# Altium project S7V30.PrjPCB (part 2 of 2)

## Sheet S7_LoRa.SchDoc
size A3
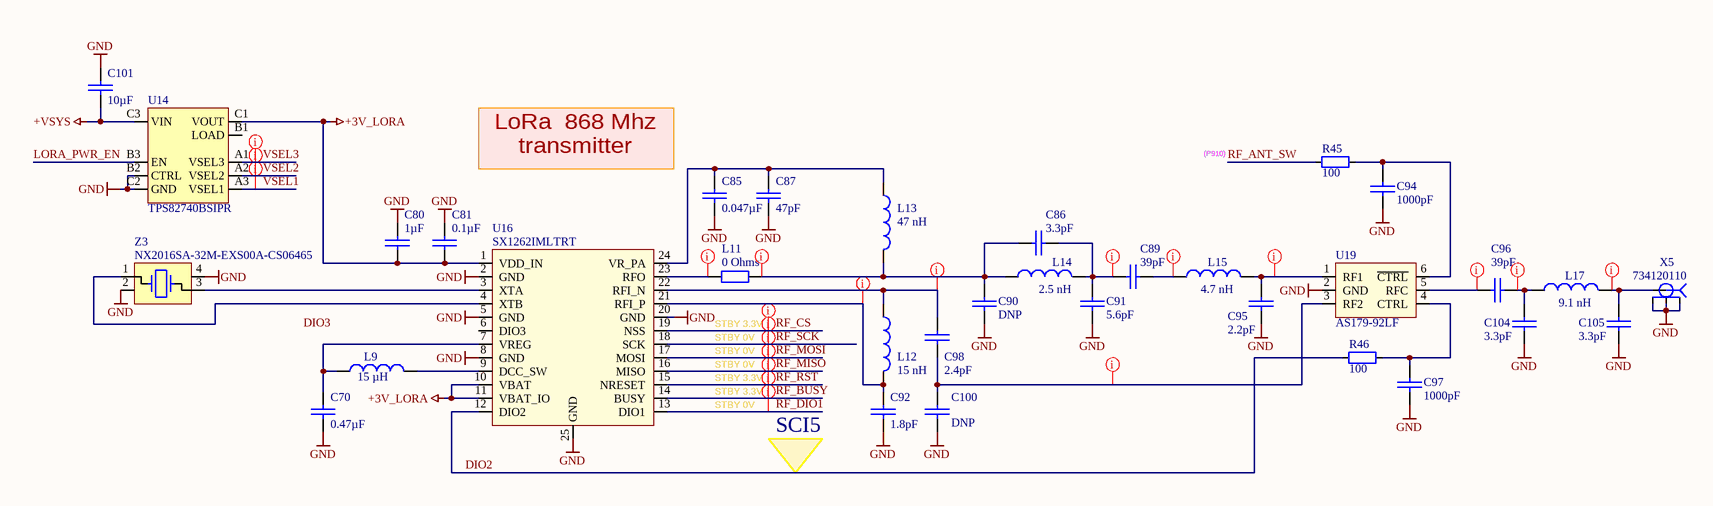
[diagram p3: S7_LoRa.SchDoc]

### Parts
C70  value 0.47µF  [0402 CAP]  (hidden comment: GRT155R61E474ME01D)
C80  value 1µF  [0402 CAP]  (hidden comment: TMK105BJ105MV-F)
C81  value 0.1µF  [0402 CAP]  (hidden comment: 0402B104K500CT)
C85  value 0.047µF  [0402 CAP]  (hidden comment: CC0402KRX7R8BB473)
C86  value 3.3pF  [0402 CAP]  (hidden comment: 885392005011)
C87  value 47pF  [0402 CAP]  (hidden comment: GJM1555C1H470FB01D)
C89  value 39pF  [0402 CAP]  (hidden comment: GJM1555C1H390JB01D)
C90  value DNP  [0402 CAP]  (hidden comment: Capacitor_0402)  (no BOM)
C91  value 5.6pF  [0402 CAP]  (hidden comment: GJM1555C1H5R6BB01D)
C92  value 1.8pF  [0402 CAP]  (hidden comment: GJM1555C1H1R8BB01D)
C94  value 1000pF  [0402 CAP]  (hidden comment: C1005CH1H102J050BA)
C95  value 2.2pF  [0402 CAP]  (hidden comment: CBR04C229B5GAC)
C96  value 39pF  [0402 CAP]  (hidden comment: GJM1555C1H390JB01D)
C97  value 1000pF  [0402 CAP]  (hidden comment: C1005CH1H102J050BA)
C98  value 2.4pF  [0402 CAP]  (hidden comment: GJM1555C1H2R4BB01D)
C100  value DNP  [0402 CAP]  (hidden comment: Capacitor_0402)  (no BOM)
C101  value 10µF  [0603 CAP]  (hidden comment: GRT188R61C106KE13D)
C104  value 3.3pF  [0402 CAP]  (hidden comment: 885392005011)
C105  value 3.3pF  [0402 CAP]  (hidden comment: 885392005011)
L9  value 15 µH  [2012[0805]]  (hidden comment: LQM21DH150M70L)
L11  value 0 Ohms  [INDC1005-0402]  (hidden comment: CRCW04020000Z0ED)
L12  value 15 nH  [INDC1005-0402]  (hidden comment: LQW15AN15NH00D)
L13  value 47 nH  [INDC1005-0402]  (hidden comment: LQW15AN47NJ00D)
L14  value 2.5 nH  [INDC1005-0402]  (hidden comment: LQW15AN2N5C00D)
L15  value 4.7 nH  [INDC1005-0402]  (hidden comment: LQW15AN4N7C00D)
L17  value 9.1 nH  [INDC1005-0402]  (hidden comment: LQW15AN9N1H00D)
R45  value 100  [0402]  (hidden comment: RMCF0402FT100R)
R46  value 100  [0402]  (hidden comment: RMCF0402FT100R)
U14  TPS82740BSIPR  [MicroSiP]
U16  SX1262IMLTRT  [VQFN24]
U19  AS179-92LF  [SC70-6]
X5  734120110  [0734120110]
Z3  NX2016SA-32M-EXS00A-CS06465  [4-SMD 2.00mm x 1.60mm]

### Nets
+3V_LORA: C80.2 C81.2 U14.C1(VOUT) U16.1(VDD_IN) U16.10(VBAT) U16.11(VBAT_IO)
+VSYS: C101.2 U14.C3(VIN)
GND: C70.2 C80.1 C81.1 C85.2 C87.2 C90.2 C91.2 C92.2 C94.1 C95.2 C97.1 C100.2 C101.1 C104.1 C105.1 U14.B2(CTRL) U14.C2(GND) U16.2(GND) U16.5(GND) U16.8(GND) U16.20(GND) U16.25(GND) U19.2(GND) X5.2 X5.3 X5.4 Z3.2 Z3.4
DIO2: R46.2 U16.12(DIO2)
LORA_PWR_EN: U14.B3(EN)
RF_ANT_SW: R45.2
RF_BUSY: U16.14(BUSY)
RF_CS: U16.19(NSS)
RF_DIO1: U16.13(DIO1)
RF_MISO: U16.16(MISO)
RF_MOSI: U16.17(MOSI)
RF_RST: U16.15(NRESET)
RF_SCK: U16.18(SCK)
VSEL1: U14.A3(VSEL1)
VSEL2: U14.A2(VSEL2)
VSEL3: U14.A1(VSEL3)
NetC70_1: C70.1 L9.1 U16.7(VREG)
NetC85_1: C85.1 C87.1 L13.1 U16.24(VR_PA)
NetC86_1: C86.1 C90.1 L11.2 L13.2 L14.1
NetC86_2: C86.2 C89.1 C91.1 L14.2
NetC89_2: C89.2 L15.1
NetC92_1: C92.1 L12.2 U16.21(RFI_P)
NetC94_2: C94.2 R45.1 U19.6(~{CTRL})
NetC95_1: C95.1 L15.2 U19.1(RF1)
NetC96_1: C96.1 U19.5(RFC)
NetC96_2: C96.2 C104.2 L17.1
NetC97_2: C97.2 R46.1 U19.4(CTRL)
NetC98_1: C98.1 L12.1 U16.22(RFI_N)
NetC98_2: C98.2 C100.1 U19.3(RF2)
NetC105_2: C105.2 L17.2 X5.1(Sig)
NetL9_2: L9.2 U16.9(DCC_SW)
NetL11_1: L11.1 U16.23(RFO)
NetU16_3: U16.3(XTA) Z3.3
NetU16_4: U16.4(XTB) Z3.1

Not connected (* = marked no-connect by the designer): U14 B1(LOAD); U16 6(DIO3)

### Layout directives
net class RF: NetC86_1, NetC86_2, NetC89_2, NetC92_1, NetC95_1, NetC96_1, NetC96_2, NetC98_1, NetC98_2, NetC105_2, NetL11_1
net class VSEL: VSEL1, VSEL2, VSEL3
net class LoRa: RF_BUSY, RF_CS, RF_DIO1, RF_MISO, RF_MOSI, RF_RST, RF_SCK

### Notes on the sheet
- (near C85) LoRa  868 Mhz transmitter
- (P910)
- STBY 3.3V
- STBY 0V
- SCI5
- Labels drawn without touching a wire or pin: DIO3

### Library data of the parts
C70 = GRT155R61E474ME01D: 0.47µF, ±20%, 25V, X5R, 0402 (1005 Metric), -55°C ~ 85°C, -, Automotive; Manufacturer: Murata Electronics North America; PartNum: 490-12270-1-ND; Voltage - Rated: 25V; Part Number: GRT155R61E474ME01D; Distributor: Digi-Key; PartName: GRT155R61E474ME01D; Price: 0.13000; Tolerance: ±20%; Temperature Coefficient: X5R; Operating Temperature: -55°C ~ 85°C; Features: -; Package / Case: 0402 (1005 Metric)
C80 = TMK105BJ105MV-F: 1µF, ±20%, 25V, X5R, 0402 (1005 Metric), -55°C ~ 85°C, -, General Purpose; Manufacturer: Taiyo Yuden; PartNum: 587-3245-1-ND; Voltage - Rated: 25V; Part Number: TMK105BJ105MV-F; Distributor: Digi-Key; PartName: TMK105BJ105MV-F; Price: 0.22000; Tolerance: ±20%; Temperature Coefficient: X5R; Operating Temperature: -55°C ~ 85°C; Features: -; Package / Case: 0402 (1005 Metric)
C81 = 0402B104K500CT: as C3 on sheet S7_Power; Voltage - Rated: 50V; Part Number: 0402B104K500CT; Distributor: Digi-Key; PartName: 0402B104K500CT; Price: 0.19000; Tolerance: ±10%; Temperature Coefficient: X7R; Operating Temperature: -55°C ~ 125°C; Features: -; Package / Case: 0402 (1005 Metric)
C85 = CC0402KRX7R8BB473: 0.047µF, ±10%, 25V, X7R, 0402 (1005 Metric), -55°C ~ 125°C, -, General Purpose; Manufacturer: Yageo; PartNum: 311-1717-1-ND; Voltage - Rated: 25V; Part Number: CC0402KRX7R8BB473; Distributor: Digi-Key; PartName: CC0402KRX7R8BB473; Price: 0.10000; Tolerance: ±10%; Temperature Coefficient: X7R; Operating Temperature: -55°C ~ 125°C; Features: -; Package / Case: 0402 (1005 Metric)
C86 C104 C105 = 885392005011: 3.3pF, ±0.1pF, 50V, C0G, NP0, 0402 (1005 Metric), -55°C ~ 125°C, -, RF, Microwave, High Frequency; Manufacturer: Wurth Electronics Inc.; PartNum: 732-13236-1-ND; Voltage - Rated: 50V; Part Number: 885392005011; Distributor: Digi-Key; PartName: 885392005011; Price: 0.10000; Tolerance: ±0.1pF; Temperature Coefficient: C0G, NP0; Operating Temperature: -55°C ~ 125°C; Features: -; Package / Case: 0402 (1005 Metric)
C87 = GJM1555C1H470FB01D: 47pF, ±1%, 50V, C0G, NP0, 0402 (1005 Metric), -55°C ~ 125°C, High Q, Low Loss, RF, Microwave, High Frequency; Manufacturer: Murata Electronics North America; PartNum: 490-16376-1-ND; Voltage - Rated: 50V; Part Number: GJM1555C1H470FB01D; Distributor: Digi-Key; PartName: GJM1555C1H470FB01D; Price: 0.28000; Tolerance: ±1%; Temperature Coefficient: C0G, NP0; Operating Temperature: -55°C ~ 125°C; Features: High Q, Low Loss; Package / Case: 0402 (1005 Metric)
C89 C96 = GJM1555C1H390JB01D: 39pF, ±5%, 50V, C0G, NP0, 0402 (1005 Metric), -55°C ~ 125°C, High Q, Low Loss, RF, Microwave, High Frequency; Manufacturer: Murata Electronics North America; PartNum: 490-17673-1-ND; Voltage - Rated: 50V; Part Number: GJM1555C1H390JB01D; Distributor: Digi-Key; PartName: GJM1555C1H390JB01D; Price: 0.24000; Tolerance: ±5%; Temperature Coefficient: C0G, NP0; Operating Temperature: -55°C ~ 125°C; Features: High Q, Low Loss; Package / Case: 0402 (1005 Metric)
C91 = GJM1555C1H5R6BB01D: 5.6pF, ±0.1pF, 50V, C0G, NP0, 0402 (1005 Metric), -55°C ~ 125°C, High Q, Low Loss, RF, Microwave, High Frequency; Manufacturer: Murata Electronics North America; PartNum: 490-11225-1-ND; Voltage - Rated: 50V; Part Number: GJM1555C1H5R6BB01D; Distributor: Digi-Key; PartName: GJM1555C1H5R6BB01D; Price: 0.19000; Tolerance: ±0.1pF; Temperature Coefficient: C0G, NP0; Operating Temperature: -55°C ~ 125°C; Features: High Q, Low Loss; Package / Case: 0402 (1005 Metric)
C92 = GJM1555C1H1R8BB01D: 1.8pF, ±0.1pF, 50V, C0G, NP0, 0402 (1005 Metric), -55°C ~ 125°C, High Q, Low Loss, RF, Microwave, High Frequency; Manufacturer: Murata Electronics North America; PartNum: 490-8089-1-ND; Voltage - Rated: 50V; Part Number: GJM1555C1H1R8BB01D; Distributor: Digi-Key; PartName: GJM1555C1H1R8BB01D; Price: 0.19000; Tolerance: ±0.1pF; Temperature Coefficient: C0G, NP0; Operating Temperature: -55°C ~ 125°C; Features: High Q, Low Loss; Package / Case: 0402 (1005 Metric)
C94 C97 = C1005CH1H102J050BA: 1000pF, ±5%, 50V, CH, 0402 (1005 Metric), -25°C ~ 85°C, Low ESL, General Purpose; Manufacturer: TDK Corporation; PartNum: 445-10829-1-ND; Voltage - Rated: 50V; Part Number: C1005CH1H102J050BA; Distributor: Digi-Key; PartName: C1005CH1H102J050BA; Price: 0.19000; Tolerance: ±5%; Temperature Coefficient: CH; Operating Temperature: -25°C ~ 85°C; Features: Low ESL; Package / Case: 0402 (1005 Metric)
C95 = CBR04C229B5GAC: 2.2pF, ±0.1pF, 50V, C0G, NP0, 0402 (1005 Metric), -55°C ~ 125°C, High Q, Low Loss, RF, Microwave, High Frequency; Manufacturer: KEMET; PartNum: 399-17527-1-ND; Voltage - Rated: 50V; Part Number: CBR04C229B5GAC; Distributor: Digi-Key; PartName: CBR04C229B5GAC; Price: 0.19000; Tolerance: ±0.1pF; Temperature Coefficient: C0G, NP0; Operating Temperature: -55°C ~ 125°C; Features: High Q, Low Loss; Package / Case: 0402 (1005 Metric)
C98 = GJM1555C1H2R4BB01D: 2.4pF, ±0.1pF, 50V, C0G, NP0, 0402 (1005 Metric), -55°C ~ 125°C, High Q, Low Loss, RF, Microwave, High Frequency; Manufacturer: Murata Electronics North America; PartNum: 490-8093-1-ND; Voltage - Rated: 50V; Part Number: GJM1555C1H2R4BB01D; Distributor: Digi-Key; PartName: GJM1555C1H2R4BB01D; Price: 0.19000; Tolerance: ±0.1pF; Temperature Coefficient: C0G, NP0; Operating Temperature: -55°C ~ 125°C; Features: High Q, Low Loss; Package / Case: 0402 (1005 Metric)
C101 = GRT188R61C106KE13D: as C1 on sheet S7_Power; Voltage - Rated: 16V; Part Number: GRT188R61C106KE13D; Distributor: Digi-Key; PartName: GRT188R61C106KE13D; Price: 0.22770; Tolerance: ±10%; Temperature Coefficient: X5R; Operating Temperature: -55°C ~ 85°C; Features: -; Package / Case: 0603 (1608 Metric)
L9 = LQM21DH150M70L: 15 µH Shielded Multilayer Inductor 250 mA, 1.235Ohm, 24MHz Max 0805 (2012 Metric); Manufacturer: Murata Electronics; PartNum: 490-LQM21DH150M70LCT-ND; Tolerance: ±20%; Distributor: Digi-Key; Price: 0.16$; PartName: LQM21DH150M70L
L11 = CRCW04020000Z0ED: 0 Ohms Jumper 0.063W, 1/16W Chip Resistor 0402 (1005 Metric) Automotive AEC-Q200 Thick Film; Manufacturer: Vishay Dale; PartNum: 541-0.0JCT-ND; Distributor: Digi-Key; PartName: CRCW04020000Z0ED
L12 = LQW15AN15NH00D: 15nH Unshielded Wirewound Inductor 460mA 160 mOhm Max 0402 (1006 Metric); Manufacturer: Murata; PartNum: 490-6772-1-ND; Tolerance: ±3%; Distributor: Digi-Key; PartName: LQW15AN15NH00D
L13 = LQW15AN47NJ00D: 47nH Unshielded Wirewound Inductor 210mA 1.08 Ohm Max 0402 (1005 Metric); Manufacturer: Murata; PartNum: 490-1154-1-ND; Tolerance: ±5%; Distributor: Digi-Key; PartName: LQW15AN47NJ00D
L14 = LQW15AN2N5C00D: 2.5nH Unshielded Wirewound Inductor 850mA 50 mOhm Max 0402 (1006 Metric); Manufacturer: Murata; PartNum: 490-6798-1-ND; Tolerance: ±0.2nH; Distributor: Digi-Key; PartName: LQW15AN2N5C00D
L15 = LQW15AN4N7C00D: 4.7nH Unshielded Wirewound Inductor 750mA 70 mOhm Max 0402 (1006 Metric); Manufacturer: Murata Electronics North America; PartNum: 490-1139-1-ND; Tolerance: ±0.2nH; Distributor: Digi-Key; PartName: LQW15AN4N7C00D
L17 = LQW15AN9N1H00D: 9.1nH Unshielded Wirewound Inductor 540mA 140 mOhm Max 0402 (1006 Metric); Manufacturer: Murata Electronics North America; PartNum: 490-8444-1-ND; Tolerance: ±3%; Distributor: Digi-Key; PartName: LQW15AN9N1H00D
R45 R46 = RMCF0402FT100R: 100 Ohms, ±1%, 0.063W, 1/16W, Thick Film, ±100ppm/°C, 0402 (1005 Metric), -55°C ~ 155°C, Automotive AEC-Q200; Manufacturer: Stackpole Electronics Inc; PartNum: RMCF0402FT100RCT-ND; Voltage: 75V; Distributor: Digi-Key; Price: 0.10000; Tolerance: ±1%; PartName: RMCF0402FT100R; Part Number: RMCF0402FT100R; Temperature Coefficient: ±100ppm/°C; Operating Temperature: -55°C ~ 155°C; Power (Watts): 0.063W, 1/16W; Features: Automotive AEC-Q200; Package / Case: 0402 (1005 Metric)
U14 = TPS82740BSIPR: Non-Isolated PoL Module DC DC Converter 1 Output 2.6 ~ 3.3V 200mA 2.2V - 5.5V Input, 3.0mm x 2.4mm x 1.0mm, -40...85 C; Manufacturer: Texas Instruments; PartNum: 296-46481-1-ND; Distributor: Digi-Key; price: 2.88$; PartName: TPS82740BSIPR
U16 = SX1262IMLTRT: IC RF TxRx Only General ISM < 1GHz LoRaWAN 150MHz ~ 960MHz 24-VFQFN Exposed Pad; Manufacturer: Semtech Corporation; PartName: SX1262IMLTRTCT-ND; Distributor: Digi-Key; PartNum: SX1262IMLTRT; Price: 7.94$
U19 = AS179-92LF: RF Switch IC 802.11b, g, Bluetooth, WLAN SPDT 3 GHz 50Ohm SC-70-6, -40°C ~ 85°C; Manufacturer: Skyworks Solutions Inc.; PartNum: 863-1003-1-ND; Distributor: Digi-Key; PartName: AS179-92LF
X5 = 0734120110: U.FL (UMCC) Connector Receptacle, Male Pin 50 Ohm Surface Mount Solder; Manufacturer: Molex; PartNum: WM5587TR-ND; Distributor: Digi-Key; PartName: 0734120110
Z3 = NX2016SA-32M-EXS00A-CS06465: 32 MHz Crystal 10pF,  60 Ohms, 10 ppm,  4-SMD, No Lead, -40...+85 С; Manufacturer: NDK America, Inc.; PartNum: 644-1300-1-ND; Tolerance: ±1ppm; Value: 32 MHz; Distributor: Digi-Key; Price: 0.38$; PartName: NX2016SA-32M-EXS00A-CS06465

## Sheet S7_SDRAM.SchDoc
size A3
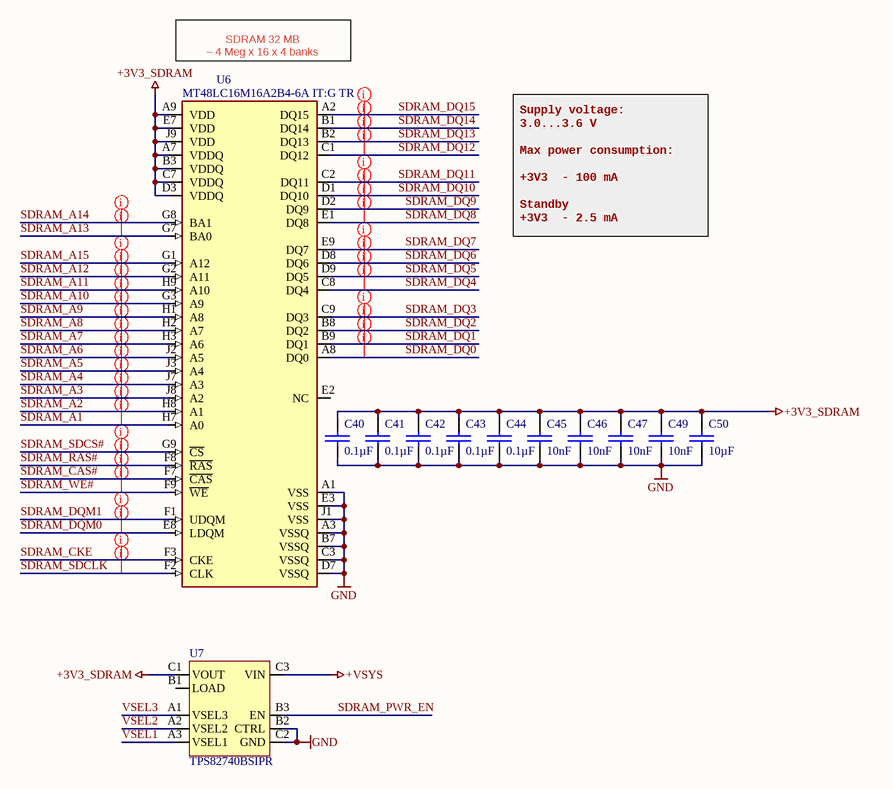
[diagram p4: S7_SDRAM.SchDoc]

### Parts
C40  value 0.1µF  [0402 CAP]  (hidden comment: 0402B104K500CT)
C41  value 0.1µF  [0402 CAP]  (hidden comment: 0402B104K500CT)
C42  value 0.1µF  [0402 CAP]  (hidden comment: 0402B104K500CT)
C43  value 0.1µF  [0402 CAP]  (hidden comment: 0402B104K500CT)
C44  value 0.1µF  [0402 CAP]  (hidden comment: 0402B104K500CT)
C45  value 10nF  [0402 CAP]  (hidden comment: CL05B103KB5NNNC)
C46  value 10nF  [0402 CAP]  (hidden comment: CL05B103KB5NNNC)
C47  value 10nF  [0402 CAP]  (hidden comment: CL05B103KB5NNNC)
C49  value 10nF  [0402 CAP]  (hidden comment: CL05B103KB5NNNC)
C50  value 10µF  [0603 CAP]  (hidden comment: GRT188R61C106KE13D)
U6  MT48LC16M16A2B4-6A IT:G TR  [MICRON_VFBGA54]
U7  TPS82740BSIPR  [MicroSiP]

### Nets
+3V3_SDRAM: C40.1 C41.1 C42.1 C43.1 C44.1 C45.1 C46.1 C47.1 C49.1 C50.1 U6.A7(VDDQ) U6.A9(VDD) U6.B3(VDDQ) U6.C7(VDDQ) U6.D3(VDDQ) U6.E7(VDD) U6.J9(VDD) U7.C1(VOUT)
+VSYS: U7.C3(VIN)
GND: C40.2 C41.2 C42.2 C43.2 C44.2 C45.2 C46.2 C47.2 C49.2 C50.2 U6.A1(VSS) U6.A3(VSSQ) U6.B7(VSSQ) U6.C3(VSSQ) U6.D7(VSSQ) U6.E3(VSS) U6.J1(VSS) U7.B2(CTRL) U7.C2(GND)
SDRAM_A1: U6.H7(A0)
SDRAM_A2: U6.H8(A1)
SDRAM_A3: U6.J8(A2)
SDRAM_A4: U6.J7(A3)
SDRAM_A5: U6.J3(A4)
SDRAM_A6: U6.J2(A5)
SDRAM_A7: U6.H3(A6)
SDRAM_A8: U6.H2(A7)
SDRAM_A9: U6.H1(A8)
SDRAM_A10: U6.G3(A9)
SDRAM_A11: U6.H9(A10)
SDRAM_A12: U6.G2(A11)
SDRAM_A13: U6.G7(BA0)
SDRAM_A14: U6.G8(BA1)
SDRAM_A15: U6.G1(A12)
SDRAM_CAS#: U6.F7(~{CAS})
SDRAM_CKE: U6.F3(CKE)
SDRAM_DQ0: U6.A8(DQ0)
SDRAM_DQ1: U6.B9(DQ1)
SDRAM_DQ2: U6.B8(DQ2)
SDRAM_DQ3: U6.C9(DQ3)
SDRAM_DQ4: U6.C8(DQ4)
SDRAM_DQ5: U6.D9(DQ5)
SDRAM_DQ6: U6.D8(DQ6)
SDRAM_DQ7: U6.E9(DQ7)
SDRAM_DQ8: U6.E1(DQ8)
SDRAM_DQ9: U6.D2(DQ9)
SDRAM_DQ10: U6.D1(DQ10)
SDRAM_DQ11: U6.C2(DQ11)
SDRAM_DQ12: U6.C1(DQ12)
SDRAM_DQ13: U6.B2(DQ13)
SDRAM_DQ14: U6.B1(DQ14)
SDRAM_DQ15: U6.A2(DQ15)
SDRAM_DQM0: U6.E8(LDQM)
SDRAM_DQM1: U6.F1(UDQM)
SDRAM_PWR_EN: U7.B3(EN)
SDRAM_RAS#: U6.F8(~{RAS})
SDRAM_SDCLK: U6.F2(CLK)
SDRAM_SDCS#: U6.G9(~{CS})
SDRAM_WE#: U6.F9(~{WE})
VSEL1: U7.A3(VSEL1)
VSEL2: U7.A2(VSEL2)
VSEL3: U7.A1(VSEL3)

Not connected (* = marked no-connect by the designer): U6 E2(NC); U7 B1(LOAD)

### Layout directives
net class SDRAM_D: SDRAM_DQ0, SDRAM_DQ1, SDRAM_DQ2, SDRAM_DQ3, SDRAM_DQ4, SDRAM_DQ5, SDRAM_DQ6, SDRAM_DQ7, SDRAM_DQ8, SDRAM_DQ9, SDRAM_DQ10, SDRAM_DQ11, SDRAM_DQ12, SDRAM_DQ13, SDRAM_DQ14, SDRAM_DQ15
net class SDRAM_A: SDRAM_A1, SDRAM_A2, SDRAM_A3, SDRAM_A4, SDRAM_A5, SDRAM_A6, SDRAM_A7, SDRAM_A8, SDRAM_A9, SDRAM_A10, SDRAM_A11, SDRAM_A12, SDRAM_A13, SDRAM_A14, SDRAM_A15
net class SDRAM_C: SDRAM_CAS#, SDRAM_CKE, SDRAM_DQM0, SDRAM_DQM1, SDRAM_RAS#, SDRAM_SDCLK, SDRAM_SDCS#, SDRAM_WE#

### Notes on the sheet
- SDRAM 32 MB
  – 4 Meg x 16 x 4 banks
- Supply voltage:
  3.0...3.6 V
  Max power consumption:
  +3V3  - 100 mA
  Standby
  +3V3  - 2.5 mA

### Library data of the parts
C40-C44 = 0402B104K500CT: as C3 on sheet S7_Power; Voltage - Rated: 50V; Part Number: 0402B104K500CT; Distributor: Digi-Key; PartName: 0402B104K500CT; Price: 0.19000; Tolerance: ±10%; Temperature Coefficient: X7R; Operating Temperature: -55°C ~ 125°C; Features: -; Package / Case: 0402 (1005 Metric)
C45-C47 C49 = CL05B103KB5NNNC: 10000pF, ±10%, 50V, X7R, 0402 (1005 Metric), -55°C ~ 125°C, -, General Purpose; Manufacturer: Samsung Electro-Mechanics; PartNum: 1276-1028-1-ND; Voltage - Rated: 50V; Part Number: CL05B103KB5NNNC; Distributor: Digi-Key; PartName: CL05B103KB5NNNC; Price: 0.10000; Tolerance: ±10%; Temperature Coefficient: X7R; Operating Temperature: -55°C ~ 125°C; Features: -; Package / Case: 0402 (1005 Metric)
C50 = GRT188R61C106KE13D: as C1 on sheet S7_Power; Voltage - Rated: 16V; Part Number: GRT188R61C106KE13D; Distributor: Digi-Key; PartName: GRT188R61C106KE13D; Price: 0.22770; Tolerance: ±10%; Temperature Coefficient: X5R; Operating Temperature: -55°C ~ 85°C; Features: -; Package / Case: 0603 (1608 Metric)
U6 = MT48LC16M16A2B4-6A IT:G TR: Micron SDRAM 256M-Bit 16Mx16, 3.3V, 167MHz, 6ns, -40°C ~ +85°C, 54-VFBGA (8x8) Pb-free; Manufacturer: Micron Technology Inc.; PartNum: 340-128306-REEL; Distributor: Mouser; PartName: MT48LC16M16A2B4-6A IT:G TR; Price: 8$
U7 = TPS82740BSIPR: as U14 on sheet S7_LoRa; Distributor: Digi-Key; price: 2.88$; PartName: TPS82740BSIPR

## Sheet S7_IO.SchDoc
size A3
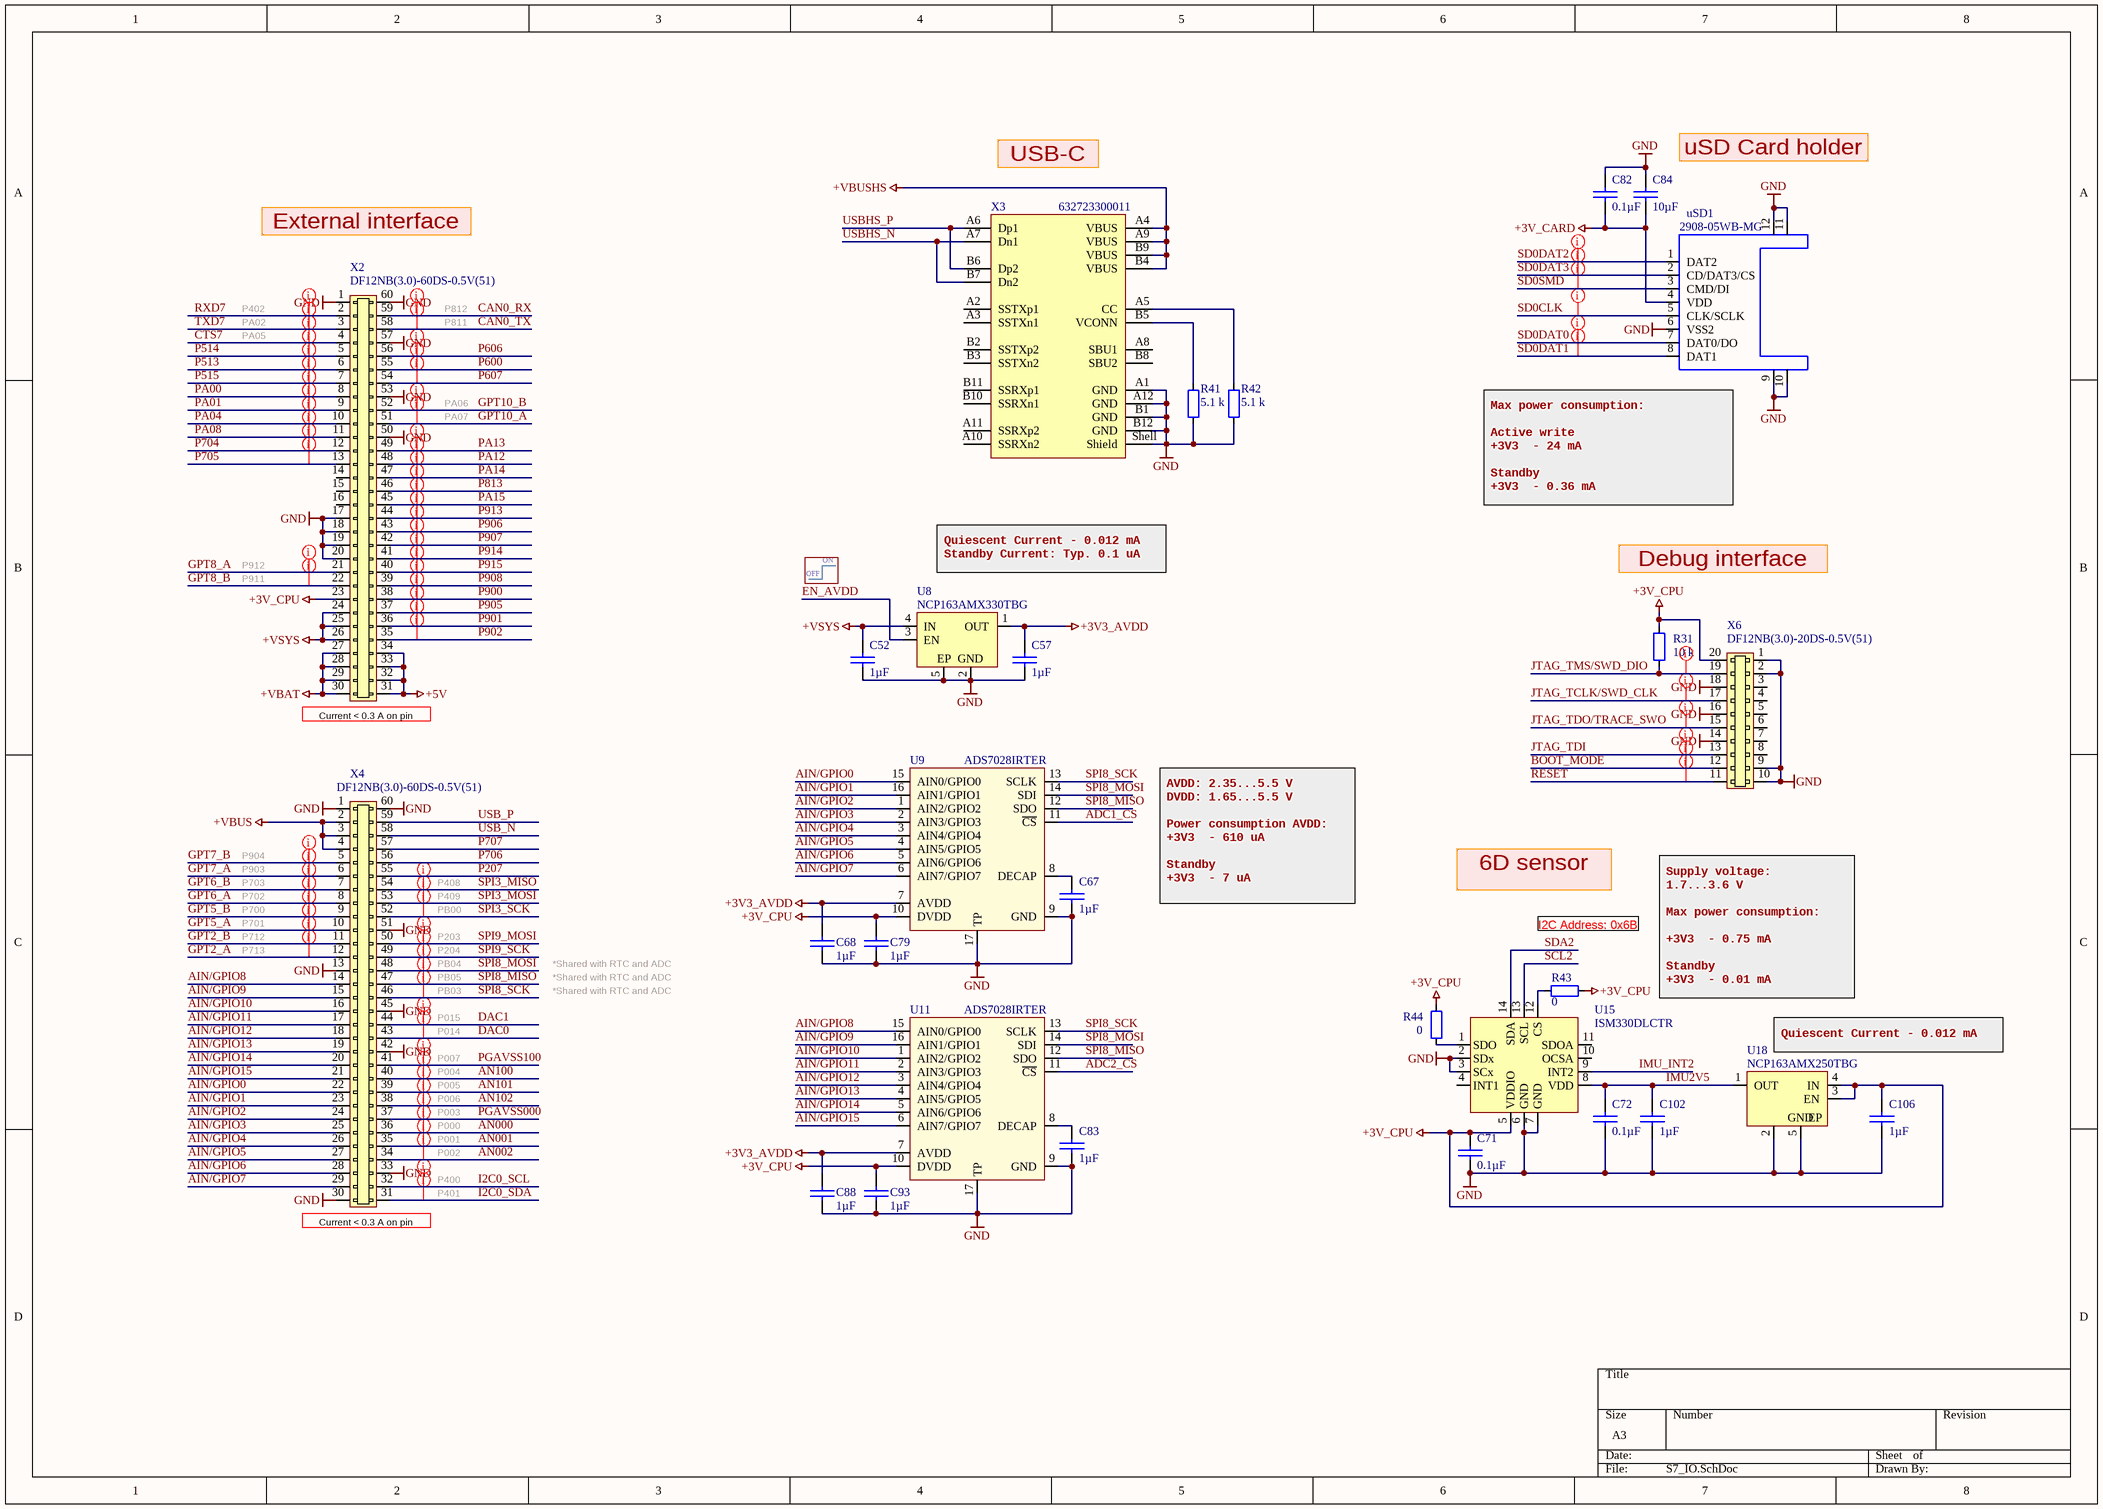
[diagram p5: S7_IO.SchDoc]

### Parts
C52  value 1µF  [0402 CAP]  (hidden comment: TMK105BJ105MV-F)
C57  value 1µF  [0402 CAP]  (hidden comment: TMK105BJ105MV-F)
C67  value 1µF  [0402 CAP]  (hidden comment: TMK105BJ105MV-F)
C68  value 1µF  [0402 CAP]  (hidden comment: TMK105BJ105MV-F)
C71  value 0.1µF  [0402 CAP]  (hidden comment: 0402B104K500CT)
C72  value 0.1µF  [0402 CAP]  (hidden comment: 0402B104K500CT)
C79  value 1µF  [0402 CAP]  (hidden comment: TMK105BJ105MV-F)
C82  value 0.1µF  [0402 CAP]  (hidden comment: 0402B104K500CT)
C83  value 1µF  [0402 CAP]  (hidden comment: TMK105BJ105MV-F)
C84  value 10µF  [0603 CAP]  (hidden comment: GRT188R61C106KE13D)
C88  value 1µF  [0402 CAP]  (hidden comment: TMK105BJ105MV-F)
C93  value 1µF  [0402 CAP]  (hidden comment: TMK105BJ105MV-F)
C102  value 1µF  [0402 CAP]  (hidden comment: TMK105BJ105MV-F)
C106  value 1µF  [0402 CAP]  (hidden comment: TMK105BJ105MV-F)
R31  value 10 k  [0402]  (hidden comment: RMCF0402FT10K0)
R41  value 5.1 k  [0402]  (hidden comment: RMCF0402FT5K10)
R42  value 5.1 k  [0402]  (hidden comment: RMCF0402FT5K10)
R43  value 0  [0402]  (hidden comment: WR04X000 PTL)
R44  value 0  [0402]  (hidden comment: WR04X000 PTL)
U8  NCP163AMX330TBG  [4-XDFN]
U9  ADS7028IRTER  [WQFN-16 3x3mm TI]
U11  ADS7028IRTER  [WQFN-16 3x3mm TI]
U15  ISM330DLCTR  [LGA-14 BOSCH]
U18  NCP163AMX250TBG  [4-XDFN]
uSD1  2908-05WB-MG  [2908-05WB-MG]
X2  DF12NB(3.0)-60DS-0.5V(51)  [DF12NB(3.0)-60DS-0.5V(51)]
X3  632723300011  [632723300011]
X4  DF12NB(3.0)-60DS-0.5V(51)  [DF12NB(3.0)-60DS-0.5V(51)]
X6  DF12NB(3.0)-20DS-0.5V(51)  [DF12NB(3.0)-20DS-0.5V(51)]

### Nets
+3V3_AVDD: C57.1 C68.1 C88.1 U8.1(OUT) U9.7(AVDD) U11.7(AVDD)
+3V_CARD: C82.2 C84.2 uSD1.4(VDD)
+3V_CPU: C71.1 C79.1 C93.1 C106.1 R31.2 R43.1 R44.2 U9.10(DVDD) U11.10(DVDD) U15.5(VDDIO) U18.3(EN) U18.4(IN) X2.23 X6.20
+5V: X2.31 X2.32 X2.33 X2.34
+VBAT: X2.27 X2.28 X2.29 X2.30
+VBUS: X4.2 X4.3 X4.4
+VBUSHS: X3.A4(VBUS) X3.A9(VBUS) X3.B4(VBUS) X3.B9(VBUS)
+VSYS: C52.1 U8.4(IN) X2.24 X2.25 X2.26
GND: C52.2 C57.2 C67.2 C68.2 C71.2 C72.2 C79.2 C82.1 C83.2 C84.1 C88.2 C93.2 C102.2 C106.2 R41.1 R42.1 U8.2(GND) U8.5(EP) U9.9(GND) U9.17(TP) U11.9(GND) U11.17(TP) U15.2(SDx) U15.3(SCx) U15.6(GND) U15.7(GND) U18.2(GND) U18.5(EP) uSD1.6(VSS2) uSD1.9 uSD1.10(WP) uSD1.11(GND) uSD1.12(GND) X2.1 X2.17 X2.18 X2.19 X2.20 X2.50 X2.53 X2.57 X2.60 X3.A1(GND) X3.A12(GND) X3.B1(GND) X3.B12(GND) X3.Shell(Shield) X4.1 X4.13 X4.30 X4.33 X4.42 X4.45 X4.51 X4.60 X6.1 X6.2 X6.9 X6.10 X6.14 X6.16 X6.18
ADC1_CS: U9.11(~{CS})
ADC2_CS: U11.11(~{CS})
AIN/GPIO0: U9.15(AIN0/GPIO0) X4.22
AIN/GPIO1: U9.16(AIN1/GPIO1) X4.23
AIN/GPIO2: U9.1(AIN2/GPIO2) X4.24
AIN/GPIO3: U9.2(AIN3/GPIO3) X4.25
AIN/GPIO4: U9.3(AIN4/GPIO4) X4.26
AIN/GPIO5: U9.4(AIN5/GPIO5) X4.27
AIN/GPIO6: U9.5(AIN6/GPIO6) X4.28
AIN/GPIO7: U9.6(AIN7/GPIO7) X4.29
AIN/GPIO8: U11.15(AIN0/GPIO0) X4.14
AIN/GPIO9: U11.16(AIN1/GPIO1) X4.15
AIN/GPIO10: U11.1(AIN2/GPIO2) X4.16
AIN/GPIO11: U11.2(AIN3/GPIO3) X4.17
AIN/GPIO12: U11.3(AIN4/GPIO4) X4.18
AIN/GPIO13: U11.4(AIN5/GPIO5) X4.19
AIN/GPIO14: U11.5(AIN6/GPIO6) X4.20
AIN/GPIO15: U11.6(AIN7/GPIO7) X4.21
AN000: X4.36
AN001: X4.35
AN002: X4.34
AN100: X4.40
AN101: X4.39
AN102: X4.38
BOOT_MODE: X6.12
CAN0_RX: X2.59
CAN0_TX: X2.58
CTS7: X2.4
DAC0: X4.43
DAC1: X4.44
EN_AVDD: U8.3(EN)
GPT2_A: X4.12
GPT2_B: X4.11
GPT5_A: X4.10
GPT5_B: X4.9
GPT6_A: X4.8
GPT6_B: X4.7
GPT7_A: X4.6
GPT7_B: X4.5
GPT8_A: X2.21
GPT8_B: X2.22
GPT10_A: X2.51
GPT10_B: X2.52
I2C0_SCL: X4.32
I2C0_SDA: X4.31
IMU2V5: C72.1 C102.1 U15.8(VDD) U18.1(OUT)
IMU_INT2: U15.9(INT2)
JTAG_TCLK/SWD_CLK: X6.17
JTAG_TDI: X6.13
JTAG_TDO/TRACE_SWO: X6.15
JTAG_TMS/SWD_DIO: R31.1 X6.19
P207: X4.55
P513: X2.6
P514: X2.5
P515: X2.7
P600: X2.55
P606: X2.56
P607: X2.54
P704: X2.12
P705: X2.13
P706: X4.56
P707: X4.57
P813: X2.46
P900: X2.38
P901: X2.36
P902: X2.35
P905: X2.37
P906: X2.43
P907: X2.42
P908: X2.39
P913: X2.44
P914: X2.41
P915: X2.40
PA00: X2.8
PA01: X2.9
PA04: X2.10
PA08: X2.11
PA12: X2.48
PA13: X2.49
PA14: X2.47
PA15: X2.45
PGAVSS000: X4.37
PGAVSS100: X4.41
RESET: X6.11
RXD7: X2.2
SCL2: U15.13(SCL)
SD0CLK: uSD1.5(CLK/SCLK)
SD0DAT0: uSD1.7(DAT0/DO)
SD0DAT1: uSD1.8(DAT1)
SD0DAT2: uSD1.1(DAT2)
SD0DAT3: uSD1.2(CD/DAT3/CS)
SD0SMD: uSD1.3(CMD/DI)
SDA2: U15.14(SDA)
SPI3_MISO: X4.54
SPI3_MOSI: X4.53
SPI3_SCK: X4.52
SPI8_MISO: U9.12(SDO) U11.12(SDO) X4.47
SPI8_MOSI: U9.14(SDI) U11.14(SDI) X4.48
SPI8_SCK: U9.13(SCLK) U11.13(SCLK) X4.46
SPI9_MOSI: X4.50
SPI9_SCK: X4.49
TXD7: X2.3
USB_N: X4.58
USB_P: X4.59
USBHS_N: X3.A7(Dn1) X3.B7(Dn2)
USBHS_P: X3.A6(Dp1) X3.B6(Dp2)
NetC67_1: C67.1 U9.8(DECAP)
NetC83_1: C83.1 U11.8(DECAP)
NetR41_2: R41.2 X3.B5(VCONN)
NetR42_2: R42.2 X3.A5(CC)
NetR43_2: R43.2 U15.12(CS)
NetR44_1: R44.1 U15.1(SDO)

Not connected (* = marked no-connect by the designer): U15 4(INT1) 10(OCSA) 11(SDOA); X2 14 15 16; X3 A2(SSTXp1) A3(SSTXn1) A8(SBU1) A10(SSRXn2) A11(SSRXp2) B2(SSTXp2) B3(SSTXn2) B8(SBU2) B10(SSRXn1) B11(SSRXp1); X6 3(2) 4(3) 5(3) 6(4) 7(4) 8(5)

### Layout directives
net class SWD: BOOT_MODE, JTAG_TCLK/SWD_CLK, JTAG_TDI, JTAG_TDO/TRACE_SWO, JTAG_TMS/SWD_DIO, RESET
net class uSD: SD0CLK, SD0DAT0, SD0DAT1, SD0DAT2, SD0DAT3, SD0SMD
net class AIN: AN000, AN001, AN002, AN100, AN101, AN102, PGAVSS000, PGAVSS100
net class I2C0: I2C0_SCL, I2C0_SDA
net class CSI8: SPI8_MISO, SPI8_MOSI, SPI8_SCK
net class CSI9: SPI9_MOSI, SPI9_SCK
net class CSI3: SPI3_MISO, SPI3_MOSI, SPI3_SCK
net class CAN0: CAN0_RX, CAN0_TX
net class CSI7: CTS7, RXD7, TXD7
net class TRACE: P813, PA12, PA13, PA14, PA15
net class MOTCTRL: GPT2_A, GPT2_B, GPT5_A, GPT5_B, GPT6_A, GPT6_B, GPT7_A, GPT7_B
net class ENCODER: GPT8_A, GPT8_B, GPT10_A, GPT10_B
net class P9: P900, P901, P902, P905, P906, P907, P908, P913, P914, P915
net class P5: P513, P514, P515
net class PA: PA00, PA01, PA04, PA08
net class P6: P600, P606, P607
net class P7: P704, P705
net class DAC: DAC0, DAC1

### Notes on the sheet
- USB-C
- (near C84) uSD Card holder
- External interface
- P402
- P812
- PA02
- PA05
- P811
- PA06
- PA07
- (near uSD1) Max power consumption:
  Active write
  +3V3  - 24 mA
  Standby
  +3V3  - 0.36 mA
- P912
- P911
- OFF
- ON
- Quiescent Current - 0.012 mA
  Standby Current: Typ. 0.1 uA
- Debug interface
- (near X2) Current < 0.3 A on pin
- P904
- P903
- P703
- P702
- P700
- P408
- P409
- PB00
- AVDD: 2.35...5.5 V
  DVDD: 1.65...5.5 V
  Power consumption AVDD:
  +3V3  - 610 uA
  Standby
  +3V3  - 7 uA
- 6D sensor
- P701
- P712
- P713
- P203
- P204
- PB04
- PB05
- PB03
- *Shared with RTC and ADC
- I2C Address: 0x6B
- Supply voltage:
  1.7...3.6 V
  Max power consumption:
  +3V3  - 0.75 mA
  Standby
  +3V3  - 0.01 mA
- P015
- P014
- (near U18) Quiescent Current - 0.012 mA
- P007
- P004
- P005
- P006
- P003
- P000
- P001
- P002
- P400
- (near X4) Current < 0.3 A on pin
- P401

### Library data of the parts
C52 C57 C67 C68 C79 C83 C88 C93 C102 C106 = TMK105BJ105MV-F: 1µF, ±20%, 25V, X5R, 0402 (1005 Metric), -55°C ~ 85°C, -, General Purpose; Manufacturer: Taiyo Yuden; PartNum: 587-3245-1-ND; Voltage - Rated: 25V; Part Number: TMK105BJ105MV-F; Distributor: Digi-Key; PartName: TMK105BJ105MV-F; Price: 0.22000; Tolerance: ±20%; Temperature Coefficient: X5R; Operating Temperature: -55°C ~ 85°C; Features: -; Package / Case: 0402 (1005 Metric)
C71 C72 C82 = 0402B104K500CT: 0.1µF, ±10%, 50V, X7R, 0402 (1005 Metric), -55°C ~ 125°C, -, General Purpose; Manufacturer: Walsin Technology Corporation; PartNum: 1292-1176-1-ND; Voltage - Rated: 50V; Part Number: 0402B104K500CT; Distributor: Digi-Key; PartName: 0402B104K500CT; Price: 0.19000; Tolerance: ±10%; Temperature Coefficient: X7R; Operating Temperature: -55°C ~ 125°C; Features: -; Package / Case: 0402 (1005 Metric)
C84 = GRT188R61C106KE13D: 10µF, ±10%, 16V, X5R, 0603 (1608 Metric), -55°C ~ 85°C, -, Automotive; Manufacturer: Murata Electronics North America; PartNum: 490-12317-1-ND; Voltage - Rated: 16V; Part Number: GRT188R61C106KE13D; Distributor: Digi-Key; PartName: GRT188R61C106KE13D; Price: 0.22770; Tolerance: ±10%; Temperature Coefficient: X5R; Operating Temperature: -55°C ~ 85°C; Features: -; Package / Case: 0603 (1608 Metric)
R31 = RMCF0402FT10K0: 10 kOhms, ±1%, 0.063W, 1/16W, Thick Film, ±100ppm/°C, 0402 (1005 Metric), -55°C ~ 155°C, Automotive AEC-Q200; Manufacturer: Stackpole Electronics Inc; PartNum: RMCF0402FT10K0CT-ND; Voltage: 75V; Distributor: Digi-Key; Price: 0.10000; Tolerance: ±1%; PartName: RMCF0402FT10K0; Part Number: RMCF0402FT10K0; Temperature Coefficient: ±100ppm/°C; Operating Temperature: -55°C ~ 155°C; Power (Watts): 0.063W, 1/16W; Features: Automotive AEC-Q200; Package / Case: 0402 (1005 Metric)
R41 R42 = RMCF0402FT5K10: 5.1 kOhms, ±1%, 0.063W, 1/16W, Thick Film, ±100ppm/°C, 0402 (1005 Metric), -55°C ~ 155°C, Automotive AEC-Q200; Manufacturer: Stackpole Electronics Inc; PartNum: RMCF0402FT5K10CT-ND; Voltage: 75V; Distributor: Digi-Key; Price: 0.10000; Tolerance: ±1%; PartName: RMCF0402FT5K10; Part Number: RMCF0402FT5K10; Temperature Coefficient: ±100ppm/°C; Operating Temperature: -55°C ~ 155°C; Power (Watts): 0.063W, 1/16W; Features: Automotive AEC-Q200; Package / Case: 0402 (1005 Metric)
R43 R44 = WR04X000 PTL: 0 Ohms Jumper 0.063W, 1/16W Chip Resistor 0402 (1005 Metric) Thick Film; Manufacturer: Walsin Technology Corporation; PartNum: 1292-WR04X000PTLCT-ND; Voltage: 50 V; Distributor: Digi-Key; Price: 0.002$; PartName: WR04X000 PTL
U8 = NCP163AMX330TBG: LDO 3.3V, 250 mA, Vin < 5.5V, Iq < 20uA, -40..+125 C,  4-XDFN (1x1); Manufacturer: ON Semiconductor; PartNum: NCP163AMX330TBGOSCT-ND; Price: 0.41$; Distributor: Digi-Key; PartName: NCP163AMX330TBG; Supplier 1: RSComponents; Supplier Part Number 1: 1349547P
U9 U11 = ADS7028IRTER: 12 Bit Analog to Digital Converter 8 Input 1 SAR, 2.35V ~ 5.5V, 16-WQFN (3x3),  -40°C ~ 85°C; Manufacturer: Texas Instruments; PartNum: 296-ADS7028IRTERCT-ND; Distributor: Digi-Key; Price: 5.1$; PartName: ADS7028IRTER; Supplier 1: Digi-Key; Supplier Part Number 1: 296-ADS7028IRTERCT-ND
U15 = ISM330DLCTR: Accelerometer, Gyroscope, Temperature, 3 Axis Sensor I²C, SPI , -40°C ~ 85°C, 14-LGA (2.5x3); Manufacturer: STMicroelectronics; PartNum: 497-17583-1-ND; Price: 6.28$; Distributor: Digi-Key; PartName: ISM330DLCTR
U18 = NCP163AMX250TBG: LDO 2.5V, 250 mA, Vin < 5.5V, Iq < 20uA, -40..+125 C,  4-XDFN (1x1); Manufacturer: ON Semiconductor; PartNum: NCP163AMX250TBGOSCT-ND; Price: 0.41$; Distributor: Digi-Key; PartName: NCP163AMX250TBG
uSD1 = 2908-05WB-MG: microSD cadr holder; Manufacturer: 3M; Price: 2.71$; Distributor: Farnell; PartNum: 2908-05WB-MG; PartName: 2908-05WB-MG; Supplier 1: RSComponents; Supplier Part Number 1: 212799
X2 X4 = DF12NB(3.0)-60DS-0.5V(51): 60 Position Connector Receptacle, Center Strip Contacts Surface Mount Gold, height 2.2 mm, pitch 0.5 mm, Mated Stacking Heights 3mm; Manufacturer: Hirose Electric; PartNum: 26-DF12NB(3.0)-60DS-0.5V(51)CT-ND; Price: 1.33$; Distributor: Digi-Key; PartName: DF12NB(3.0)-60DS-0.5V(51); Supplier 1: Digi-Key; Supplier Part Number 1: 26-DF12NB(3.0)-60DS-0.5V(51)CT-ND
X3 = 632723300011: WR-USB 3.1 Type C, Receptacle, Horizontal, THR; Manufacturer: Wurth Elektronik; Interface Type: Type C; Number of Ports: 1; Rated Current: 5A; Working Voltage: 20VAC; ComponentLink1Description: Website Link; ComponentLink1URL: https://www.we-online.com/redexpert/article/632723300011?ad; ComponentLink2Description: Datasheet Link; ComponentLink2URL: https://www.we-online.com/redexpert/spec/632723300011?ad; Manufacturer Part Number: 632723300011; Category: Input/Output Connectors; Match Code: WR-USB; Mount: Surface Mount; Operating Temperature Max: 105°C; Operating Temperature Min: -40°C; Packaging: Tape and Reel; Application: USB 3.1; Gender: Receptacle; Number of Pins: 24; Orientation: Horizontal; Supplier 1: RSComponents; Supplier Part Number 1: 1622301P
X6 = DF12NB(3.0)-20DS-0.5V(51): 20 Position Connector Receptacle, Center Strip Contacts Surface Mount Gold, height 2.2 mm, pitch 0.5 mm, Mated Stacking Heights 3mm; Manufacturer: Hirose Electric; PartNum: 26-DF12NB(3.0)-20DS-0.5V(51)CT-ND - Cut Tape (CT); Price: 064$; Distributor: Digi-Key; PartName: DF12NB(3.0)-20DS-0.5V(51); Supplier 1: Farnell; Supplier Part Number 1: 3587388

## Nets that join several sheets
+3V_CARD: S7_Power (U10.B1), S7_IO (C82.2 C84.2 uSD1.4)
+3V_CPU: S7_Power (42 pins), S7_WiFi (R38.1 U22.3), S7_IO (14 pins)
+5V: S7_Power (10 pins), S7_IO (X2.31 X2.32 X2.33 X2.34)
+VBAT: S7_Power (7 pins), S7_IO (X2.27 X2.28 X2.29 X2.30)
+VBUS: S7_Power (C3.2 R1.1 U1.1 VD3.2), S7_IO (X4.2 X4.3 X4.4)
+VBUSHS: S7_Power (6 pins), S7_IO (X3.A4 X3.A9 X3.B4 X3.B9)
+VSYS: S7_Power (9 pins), S7_WiFi (U21.3), S7_LoRa (C101.2 U14.C3), S7_SDRAM (U7.C3), S7_IO (5 pins)
GND: S7_Power (95 pins), S7_WiFi (34 pins), S7_LoRa (28 pins), S7_SDRAM (19 pins), S7_IO (62 pins)
ADC1_CS: S7_CPU (U17.J11), S7_IO (U9.11)
ADC2_CS: S7_CPU (U17.H11), S7_IO (U11.11)
AN000: S7_CPU (U17.R12), S7_IO (X4.36)
AN001: S7_CPU (U17.P11), S7_IO (X4.35)
AN002: S7_CPU (U17.N12), S7_IO (X4.34)
AN100: S7_CPU (U17.M11), S7_IO (X4.40)
AN101: S7_CPU (U17.R11), S7_IO (X4.39)
AN102: S7_CPU (U17.P10), S7_IO (X4.38)
BOOT_MODE: S7_Power (BT3.1 BT3.2 R7.1 U17.C8), S7_IO (X6.12)
BT_REG_ON: S7_CPU (U17.P3), S7_WiFi (MOD1.32)
BT_WAKE: S7_CPU (U17.M10), S7_WiFi (MOD1.47)
CAN0_RX: S7_CPU (U17.L6), S7_IO (X2.59)
CAN0_TX: S7_CPU (U17.L5), S7_IO (X2.58)
CARD_PWR_EN: S7_CPU (U17.K8), S7_Power (U10.B2)
CHARGER_INT: S7_CPU (U17.J5), S7_Power (R34.1 U3.7)
CLK32768: S7_Power (C62.1 U17.J14 Z4.2), S7_WiFi (R39.2)
CTS7: S7_CPU (U17.J3), S7_IO (X2.4)
DAC0: S7_CPU (U17.M9), S7_IO (X4.43)
DAC1: S7_CPU (U17.M8), S7_IO (X4.44)
EN_AVDD: S7_CPU (U17.G11), S7_IO (U8.3)
GPT2_A: S7_CPU (U17.G10), S7_IO (X4.12)
GPT2_B: S7_CPU (U17.F11), S7_IO (X4.11)
GPT5_A: S7_CPU (U17.M15), S7_IO (X4.10)
GPT5_B: S7_CPU (U17.M14), S7_IO (X4.9)
GPT6_A: S7_CPU (U17.K11), S7_IO (X4.8)
GPT6_B: S7_CPU (U17.J8), S7_IO (X4.7)
GPT7_A: S7_CPU (U17.D9), S7_IO (X4.6)
GPT7_B: S7_CPU (U17.C9), S7_IO (X4.5)
GPT8_A: S7_CPU (U17.B7), S7_IO (X2.21)
GPT8_B: S7_CPU (U17.A7), S7_IO (X2.22)
GPT10_A: S7_CPU (U17.J1), S7_IO (X2.51)
GPT10_B: S7_CPU (U17.J2), S7_IO (X2.52)
I2C0_SCL: S7_CPU (U17.N13), S7_IO (X4.32)
I2C0_SDA: S7_CPU (U17.P15), S7_IO (X4.31)
IMU_INT2: S7_CPU (U17.R10), S7_IO (U15.9)
JTAG_TCLK/SWD_CLK: S7_CPU (U17.F5), S7_IO (X6.17)
JTAG_TDI: S7_CPU (U17.C2), S7_IO (X6.13)
JTAG_TDO/TRACE_SWO: S7_CPU (U17.B1), S7_IO (X6.15)
JTAG_TMS/SWD_DIO: S7_CPU (U17.B2), S7_IO (R31.1 X6.19)
LED_B: S7_CPU (U17.C11), S7_Power (R15.1)
LED_G: S7_CPU (U17.F9), S7_Power (R14.1)
LED_R: S7_CPU (U17.E10), S7_Power (R13.1)
LORA_PWR_EN: S7_CPU (U17.K7), S7_LoRa (U14.B3)
P207: S7_CPU (U17.C13), S7_IO (X4.55)
P513: S7_CPU (U17.P13), S7_IO (X2.6)
P514: S7_CPU (U17.P14), S7_IO (X2.5)
P515: S7_CPU (U17.K9), S7_IO (X2.7)
P600: S7_CPU (U17.L3), S7_IO (X2.55)
P606: S7_CPU (U17.K6), S7_IO (X2.56)
P607: S7_CPU (U17.K5), S7_IO (X2.54)
P704: S7_CPU (U17.J10), S7_IO (X2.12)
P705: S7_CPU (U17.L13), S7_IO (X2.13)
P706: S7_CPU (U17.L14), S7_IO (X4.56)
P707: S7_CPU (U17.L15), S7_IO (X4.57)
P813: S7_CPU (U17.G1), S7_IO (X2.46)
P900: S7_CPU (U17.E9), S7_IO (X2.38)
P901: S7_CPU (U17.B11), S7_IO (X2.36)
P902: S7_CPU (U17.A11), S7_IO (X2.35)
P905: S7_CPU (U17.A6), S7_IO (X2.37)
P906: S7_CPU (U17.F6), S7_IO (X2.43)
P907: S7_CPU (U17.F7), S7_IO (X2.42)
P908: S7_CPU (U17.E7), S7_IO (X2.39)
P913: S7_CPU (U17.H8), S7_IO (X2.44)
P914: S7_CPU (U17.E5), S7_IO (X2.41)
P915: S7_CPU (U17.E6), S7_IO (X2.40)
PA00: S7_CPU (U17.J7), S7_IO (X2.8)
PA01: S7_CPU (U17.J6), S7_IO (X2.9)
PA04: S7_CPU (U17.J4), S7_IO (X2.10)
PA08: S7_CPU (U17.G7), S7_IO (X2.11)
PA12: S7_CPU (U17.G5), S7_IO (X2.48)
PA13: S7_CPU (U17.H7), S7_IO (X2.49)
PA14: S7_CPU (U17.G3), S7_IO (X2.47)
PA15: S7_CPU (U17.G2), S7_IO (X2.45)
PGAVSS000: S7_CPU (U17.L10), S7_IO (X4.37)
PGAVSS100: S7_CPU (U17.L9), S7_IO (X4.41)
PWR_SEL: S7_CPU (U17.G6), S7_Power (U3.2)
RESET: S7_Power (C5.1 R9.1 U4.1 U17.F8), S7_IO (X6.11)
RF_ANT_SW: S7_CPU (U17.D8), S7_LoRa (R45.2)
RF_BUSY: S7_CPU (U17.H4), S7_LoRa (U16.14)
RF_CS: S7_CPU (U17.N6), S7_LoRa (U16.19)
RF_DIO1: S7_CPU (U17.H5), S7_LoRa (U16.13)
RF_MISO: S7_CPU (U17.N7), S7_LoRa (U16.16)
RF_MOSI: S7_CPU (U17.P6), S7_LoRa (U16.17)
RF_RST: S7_CPU (U17.E8), S7_LoRa (U16.15)
RF_SCK: S7_CPU (U17.M7), S7_LoRa (U16.18)
RTC_CS: S7_CPU (U17.E11), S7_Power (U4.12)
RTC_IRQ: S7_CPU (U17.N10), S7_Power (R23.2 U4.11)
RXD7: S7_CPU (U17.N14), S7_IO (X2.2)
SCI1_CTS: S7_CPU (U17.E12), S7_WiFi (MOD1.46)
SCI1_RTS: S7_CPU (U17.F10), S7_WiFi (MOD1.44)
SCI1_RXD: S7_CPU (U17.D15), S7_WiFi (MOD1.43)
SCI1_TXD: S7_CPU (U17.E13), S7_WiFi (MOD1.45)
SCL2: S7_CPU (U17.R14), S7_Power (R32.1 U3.5 U5.B1), S7_IO (U15.13)
SD0CLK: S7_CPU (U17.D12), S7_IO (uSD1.5)
SD0DAT0: S7_CPU (U17.D14), S7_IO (uSD1.7)
SD0DAT1: S7_CPU (U17.C15), S7_IO (uSD1.8)
SD0DAT2: S7_CPU (U17.G9), S7_IO (uSD1.1)
SD0DAT3: S7_CPU (U17.C12), S7_IO (uSD1.2)
SD0SMD: S7_CPU (U17.D13), S7_IO (uSD1.3)
SD1CLK: S7_CPU (U17.R4), S7_WiFi (MOD1.15)
SD1DAT0: S7_CPU (U17.N5), S7_WiFi (MOD1.9)
SD1DAT1: S7_CPU (U17.P5), S7_WiFi (MOD1.10)
SD1DAT2: S7_CPU (U17.R5), S7_WiFi (MOD1.13)
SD1DAT3: S7_CPU (U17.M5), S7_WiFi (MOD1.11)
SD1SMD: S7_CPU (U17.N4), S7_WiFi (MOD1.12)
SDA2: S7_CPU (U17.R15), S7_Power (R29.1 U3.6 U5.C1), S7_IO (U15.14)
SDRAM_A1: S7_CPU (U17.E3), S7_SDRAM (U6.H7)
SDRAM_A2: S7_CPU (U17.E4), S7_SDRAM (U6.H8)
SDRAM_A3: S7_CPU (U17.D3), S7_SDRAM (U6.J8)
SDRAM_A4: S7_CPU (U17.C3), S7_SDRAM (U6.J7)
SDRAM_A5: S7_CPU (U17.C1), S7_SDRAM (U6.J3)
SDRAM_A6: S7_CPU (U17.B3), S7_SDRAM (U6.J2)
SDRAM_A7: S7_CPU (U17.A2), S7_SDRAM (U6.H3)
SDRAM_A8: S7_CPU (U17.A3), S7_SDRAM (U6.H2)
SDRAM_A9: S7_CPU (U17.C4), S7_SDRAM (U6.H1)
SDRAM_A10: S7_CPU (U17.D4), S7_SDRAM (U6.G3)
SDRAM_A11: S7_CPU (U17.D5), S7_SDRAM (U6.H9)
SDRAM_A12: S7_CPU (U17.D6), S7_SDRAM (U6.G2)
SDRAM_A13: S7_CPU (U17.D7), S7_SDRAM (U6.G7)
SDRAM_A14: S7_CPU (U17.C5), S7_SDRAM (U6.G8)
SDRAM_A15: S7_CPU (U17.C6), S7_SDRAM (U6.G1)
SDRAM_CAS#: S7_CPU (U17.B6), S7_SDRAM (U6.F7)
SDRAM_CKE: S7_CPU (U17.G4), S7_SDRAM (U6.F3)
SDRAM_DQ0: S7_CPU (U17.R1), S7_SDRAM (U6.A8)
SDRAM_DQ1: S7_CPU (U17.P1), S7_SDRAM (U6.B9)
SDRAM_DQ2: S7_CPU (U17.N1), S7_SDRAM (U6.B8)
SDRAM_DQ3: S7_CPU (U17.N2), S7_SDRAM (U6.C9)
SDRAM_DQ4: S7_CPU (U17.N3), S7_SDRAM (U6.C8)
SDRAM_DQ5: S7_CPU (U17.M3), S7_SDRAM (U6.D9)
SDRAM_DQ6: S7_CPU (U17.L4), S7_SDRAM (U6.D8)
SDRAM_DQ7: S7_CPU (U17.K4), S7_SDRAM (U6.E9)
SDRAM_DQ8: S7_CPU (U17.F2), S7_SDRAM (U6.E1)
SDRAM_DQ9: S7_CPU (U17.F3), S7_SDRAM (U6.D2)
SDRAM_DQ10: S7_CPU (U17.F1), S7_SDRAM (U6.D1)
SDRAM_DQ11: S7_CPU (U17.K1), S7_SDRAM (U6.C2)
SDRAM_DQ12: S7_CPU (U17.K2), S7_SDRAM (U6.C1)
SDRAM_DQ13: S7_CPU (U17.K3), S7_SDRAM (U6.B2)
SDRAM_DQ14: S7_CPU (U17.P2), S7_SDRAM (U6.B1)
SDRAM_DQ15: S7_CPU (U17.R2), S7_SDRAM (U6.A2)
SDRAM_DQM0: S7_CPU (U17.L2), S7_SDRAM (U6.E8)
SDRAM_DQM1: S7_CPU (U17.F4), S7_SDRAM (U6.F1)
SDRAM_PWR_EN: S7_CPU (U17.P12), S7_SDRAM (U7.B3)
SDRAM_RAS#: S7_CPU (U17.C7), S7_SDRAM (U6.F8)
SDRAM_SDCLK: S7_CPU (U17.L1), S7_SDRAM (U6.F2)
SDRAM_SDCS#: S7_CPU (U17.E2), S7_SDRAM (U6.G9)
SDRAM_WE#: S7_CPU (U17.E1), S7_SDRAM (U6.F9)
SPI3_MISO: S7_CPU (U17.B15), S7_IO (X4.54)
SPI3_MOSI: S7_CPU (U17.C14), S7_IO (X4.53)
SPI3_SCK: S7_CPU (U17.H9), S7_IO (X4.52)
SPI8_MISO: S7_CPU (U17.J12), S7_Power (U4.6), S7_IO (U9.12 U11.12 X4.47)
SPI8_MOSI: S7_CPU (U17.H10), S7_Power (U4.9), S7_IO (U9.14 U11.14 X4.48)
SPI8_SCK: S7_CPU (U17.K12), S7_Power (U4.7), S7_IO (U9.13 U11.13 X4.46)
SPI9_MOSI: S7_CPU (U17.B12), S7_IO (X4.50)
SPI9_SCK: S7_CPU (U17.D11), S7_IO (X4.49)
SYSV_V: S7_CPU (U17.M6), S7_Power (C25.1 R19.2 R21.1)
TXD7: S7_CPU (U17.H6), S7_IO (X2.3)
U5V_V: S7_CPU (U17.N11), S7_Power (C24.1 R18.2 R20.1)
USB_N: S7_Power (U1.5 U17.B14), S7_IO (X4.58)
USB_P: S7_Power (U1.6 U17.A14), S7_IO (X4.59)
USB_STATE: S7_CPU (U17.A15), S7_Power (C4.2 R1.2 R2.1)
USBHS_N: S7_Power (U2.5 U17.F15), S7_IO (X3.A7 X3.B7)
USBHS_P: S7_Power (U2.6 U17.F14), S7_IO (X3.A6 X3.B6)
USBHS_STATE: S7_CPU (U17.K13), S7_Power (C8.2 R3.2 R11.1)
VBUSCTRL: S7_CPU (U17.G8), S7_Power (U20.C2)
VSEL1: S7_CPU (U17.M4), S7_Power (U10.A3), S7_LoRa (U14.A3), S7_SDRAM (U7.A3)
VSEL2: S7_CPU (U17.P4), S7_Power (U10.A2), S7_LoRa (U14.A2), S7_SDRAM (U7.A2)
VSEL3: S7_CPU (U17.R3), S7_Power (U10.A1), S7_LoRa (U14.A1), S7_SDRAM (U7.A1)
WDT_RESET: S7_CPU (U17.E14), S7_Power (U4.2)
WIFI_REG_ON: S7_CPU (U17.R13), S7_WiFi (U21.4 U22.4)

## Assembly variants
Base: not fitted R12 R17 R25 R36 X1
Minimal: not fitted BT1 BT2 BT3 C1 C2 C25 C32 C33 C34 C35 C36 C37 C38 C39 C51 C53 C54 C55 C58 C59 C63 C64 C65 C66 C69 C70 C71 C72 C73 C74 C75 C76 C78 C80 C81 C85 C86 C87 C89 C90 C91 C92 C94 C95 C96 C97 C98 C100 C101 C102 C104 C105 C106 C107 C108 C109 L1 L9 L10 L11 L12 L13 L14 L15 L17 M4 MOD1 R5 R6 R19 R21 R22 R23 R24 R25 R26 R27 R28 R30 R33 R34 R35 R36 R37 R38 R39 R43 R44 R45 R46 U3 U4 U5 U12 U13 U14 U15 U16 U18 U19 U21 U22 X1 X5 Z2 Z3 Z5